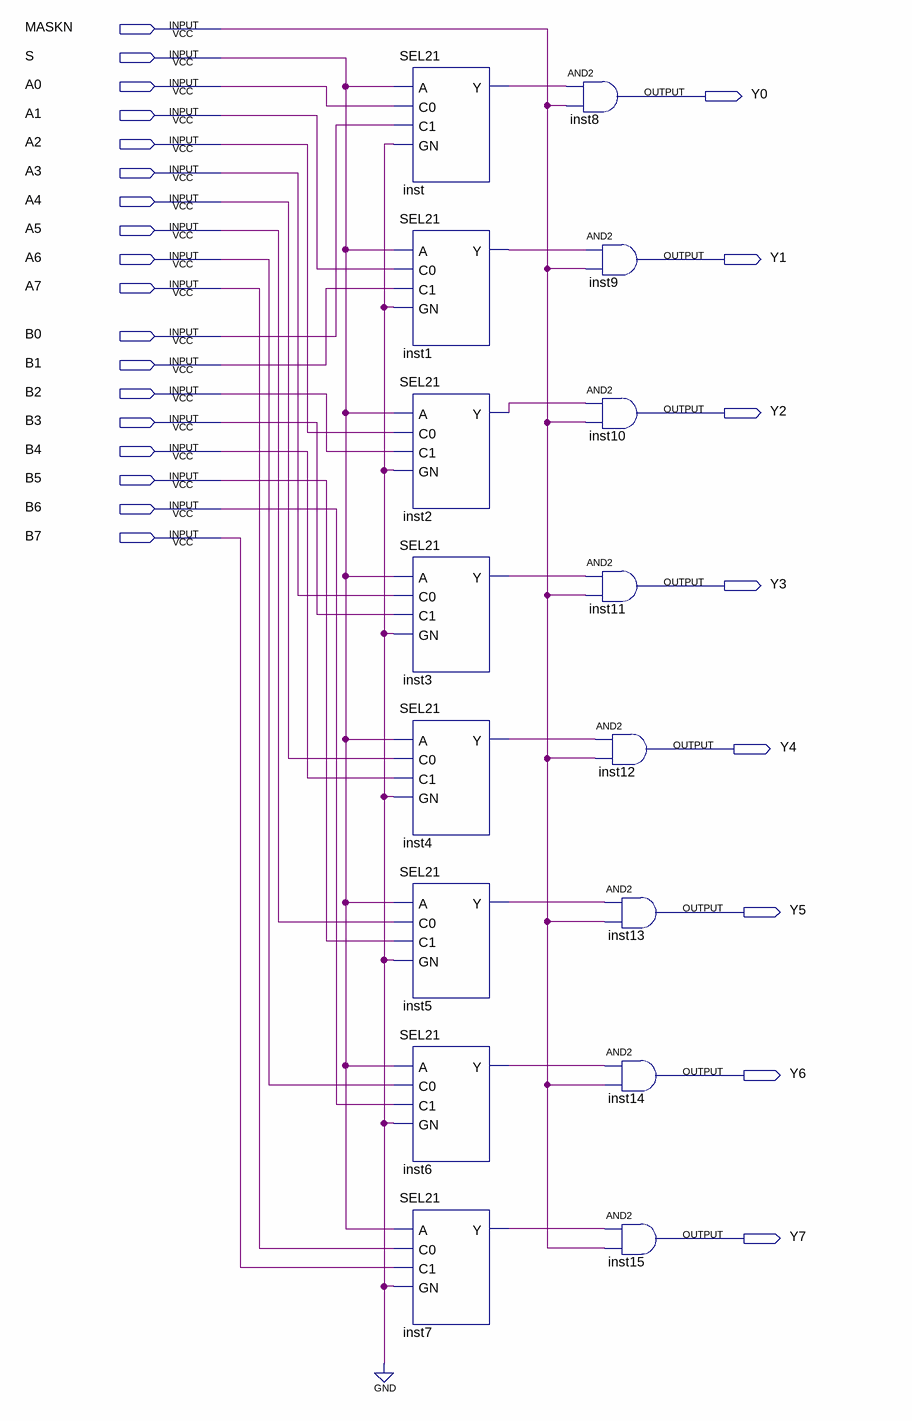
[diagram p0: schematic sheet]
// Quartus schematic SEL218X.bdf as structural Verilog: 16 symbols, 26 pins
module SEL218X (
  input  MASKN,
  input  S,
  input  A0,
  input  A1,
  input  A2,
  input  A3,
  input  A4,
  input  A5,
  input  A6,
  input  A7,
  input  B0,
  input  B1,
  input  B2,
  input  B3,
  input  B4,
  input  B5,
  input  B6,
  input  B7,
  output Y0,
  output Y1,
  output Y2,
  output Y3,
  output Y4,
  output Y5,
  output Y6,
  output Y7
);

  wire inst1_y, inst2_y, inst3_y, inst4_y, inst5_y, inst6_y, inst7_y, inst_y;

  SEL21 inst (.A(S), .C0(A0), .C1(B0), .GN(1'b0), .Y(inst_y));
  SEL21 inst1 (.A(S), .C0(A1), .C1(B1), .GN(1'b0), .Y(inst1_y));
  SEL21 inst2 (.A(S), .C0(A2), .C1(B2), .GN(1'b0), .Y(inst2_y));
  SEL21 inst3 (.A(S), .C0(A3), .C1(B3), .GN(1'b0), .Y(inst3_y));
  SEL21 inst4 (.A(S), .C0(A4), .C1(B4), .GN(1'b0), .Y(inst4_y));
  SEL21 inst5 (.A(S), .C0(A5), .C1(B5), .GN(1'b0), .Y(inst5_y));
  SEL21 inst6 (.A(S), .C0(A6), .C1(B6), .GN(1'b0), .Y(inst6_y));
  SEL21 inst7 (.A(S), .C0(A7), .C1(B7), .GN(1'b0), .Y(inst7_y));
  and inst8 (Y0, inst_y, MASKN);
  and inst9 (Y1, inst1_y, MASKN);
  and inst10 (Y2, inst2_y, MASKN);
  and inst11 (Y3, inst3_y, MASKN);
  and inst12 (Y4, inst4_y, MASKN);
  and inst13 (Y5, inst5_y, MASKN);
  and inst14 (Y6, inst6_y, MASKN);
  and inst15 (Y7, inst7_y, MASKN);
endmodule
